# EAGLE design ppLight (EAGLE 7.2.0)
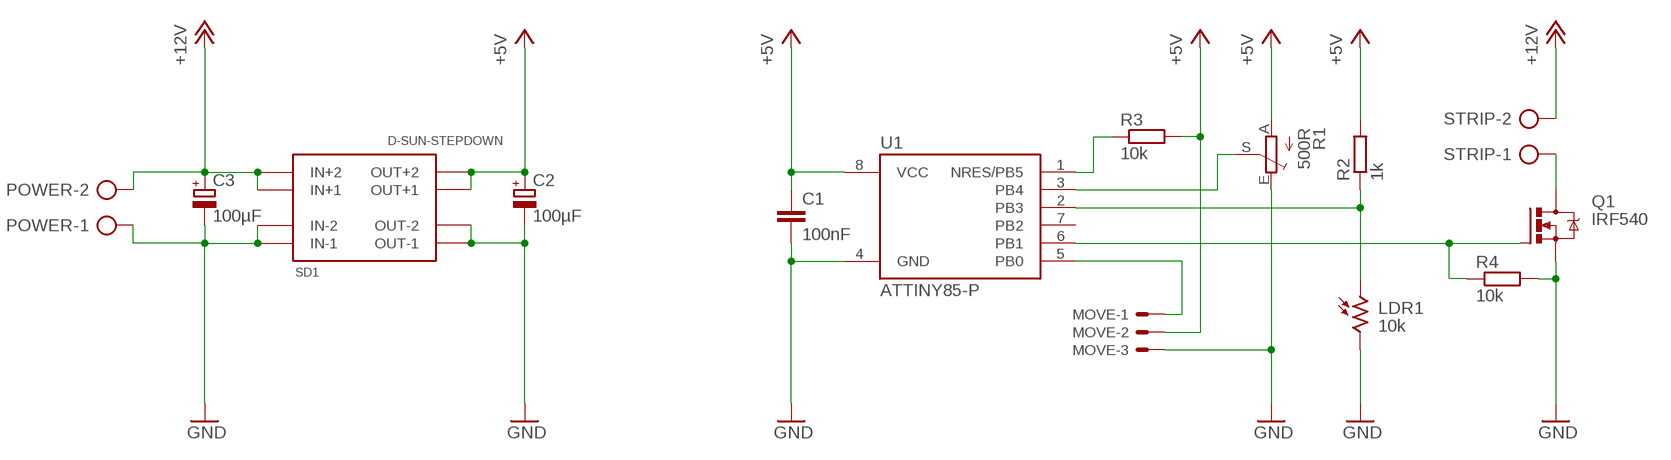
[diagram p0: schematic, sheet 1]

## Parts
C1  100nF  C-EU025-025X050  [C025-025X050]
C2  100µF  CPOL-EUE2.5-5  [E2,5-5]
C3  100µF  CPOL-EUE2.5-5  [E2,5-5]
LDR1  10k  VT90N1  [VT900]
MOVE  22-05-7038-03  [7395-03]
POWER  AK500/2  [AK500/2]
Q1  IRF540  [TO220BV]
R1  500R  TRIM_EU-CT6  [CT6]
R2  1k  R-EU_0204/7  [0204/7]
R3  10k  R-EU_0204/7  [0204/7]
R4  10k  R-EU_0204/7  [0204/7]
SD1  D-SUN-STEPDOWN  [STEPDOWN-21X16]
STRIP  AK500/2  [AK500/2]
U1  ATTINY85-P  [PDIP08_300MIL]

## Nets
+5V: C1.1 C2.+ MOVE.2 R1.A R2.2 R3.2 SD1.OUT+1 SD1.OUT+2 U1.8(VCC)
+12V: C3.+ POWER.2 SD1.IN+1 SD1.IN+2 STRIP.2
GND: C1.2 C2.- C3.- LDR1.2 MOVE.3 POWER.1 Q1.S R1.E R4.2 SD1.IN-1 SD1.IN-2 SD1.OUT-1 SD1.OUT-2 U1.4(GND)
N$1: R1.S U1.3(PB4)
N$2: Q1.D STRIP.1
N$3: R3.1 U1.1(NRES/PB5)
N$4: Q1.G R4.1 U1.6(PB1)
N$5: LDR1.1 R2.1 U1.2(PB3)
N$6: MOVE.1 U1.5(PB0)
Unconnected: U1.7(PB2)

## Library data of the parts
C1 = rcl:C-EU: CAPACITOR, European symbol
C2 C3 = rcl:CPOL-EU: POLARIZED CAPACITOR, European symbol
LDR1 = photo-elements:VT9: Photoconductive Cell VT900 Series Source: http://optoelectronics.perkinelmer.com/content/Datasheets/DTS_vt900seriesdatasheet.pdf
MOVE = con-molex:22-?-03: CONNECTOR wire to board 2.54 mm (.1 inch) pitch header; OC_FARNELL: unknown; OC_NEWARK: unknown
POWER STRIP = con-ptr500:AK500/2: CONNECTOR; OC_FARNELL: unknown; OC_NEWARK: unknown
Q1 = transistor-power:IRF540: HEXFET Power MOSFET
R1 = pot:TRIM_EU-: POTENTIOMETER
R2-R4 = rcl:R-EU_: RESISTOR, European symbol
SD1 = Zap-Powerconverters:D-SUN-STEPDOWN: Step-Down-Modul (D-Sun) Step-Down-Modul vom Ebay-Chinesen. Geht von 4,5V-28V auf 0,8V-20V, maximal 3A. Die Pins sind nicht 100% passend im Raster, lassen sich aber so hinbiegen, dass das nicht auffällt.
U1 = _hhn_attiny25_45_85:ATTINY85*: ATMEL ATtiny 85 Packages: P = PDIP 08 30mil S = SOIC 08 EIAJ 208mil Technologies Note: for complete ordering code (temp. range, finish, tape&reel etc.) see www.atmel.com • Supply Voltage: V = (1.8…5.5)V | [blank] = (2.7…5.5)V • Speed: 10 = 10 MHz | 20 = 20 MHz Author: Dipl.-Ing. FH Rainer Bayer HHN Hochschule Heilbronn (Heilbronn University), rainer.bayer@hs-heilbronn.de Ingenieurbüro ing-rb, mail@ing-rb.de

## Board
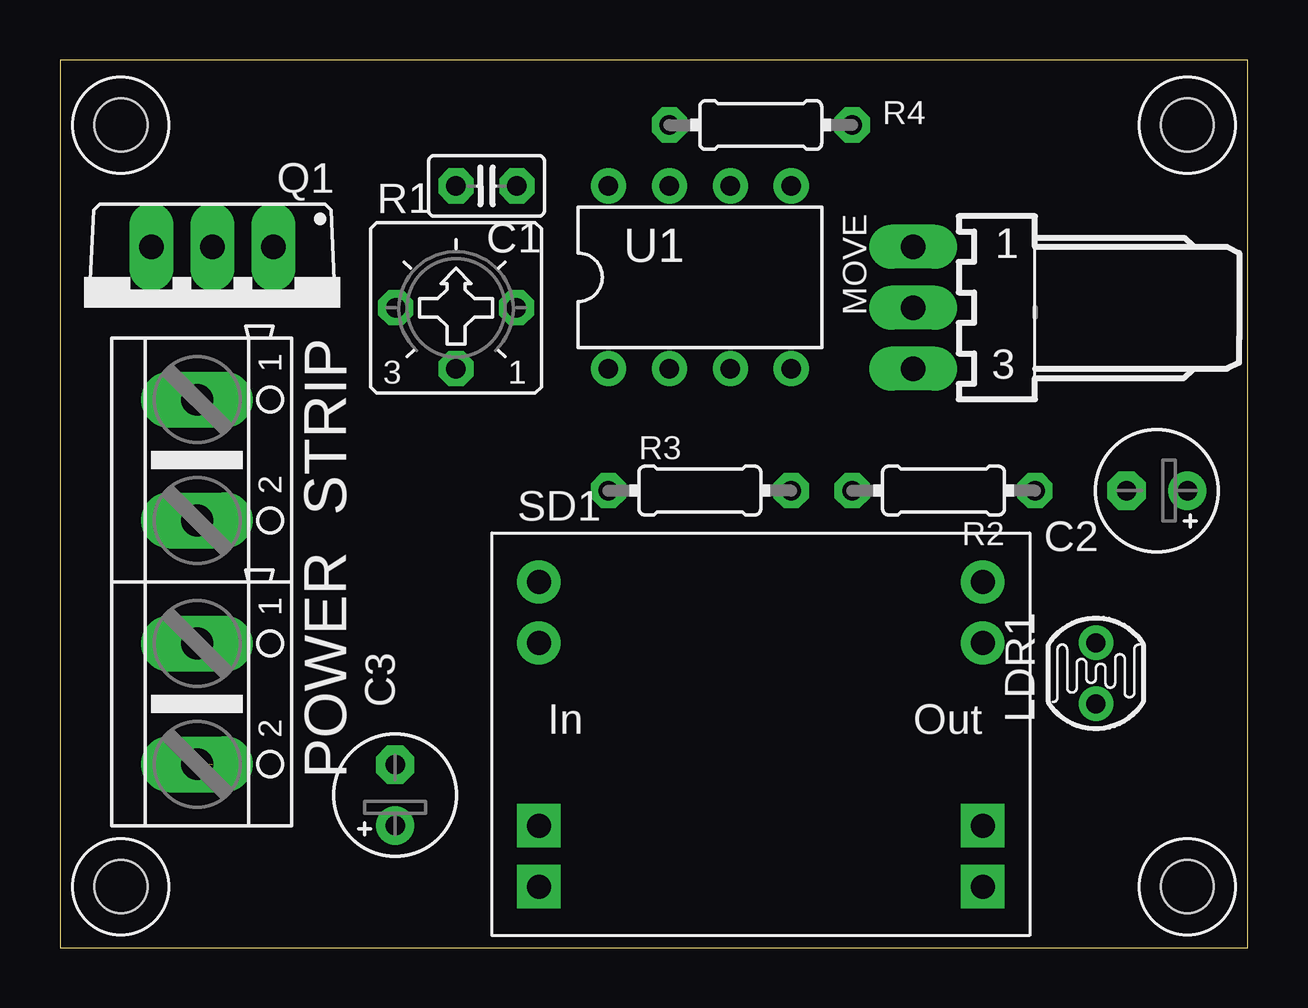
[diagram p1: board, top side]
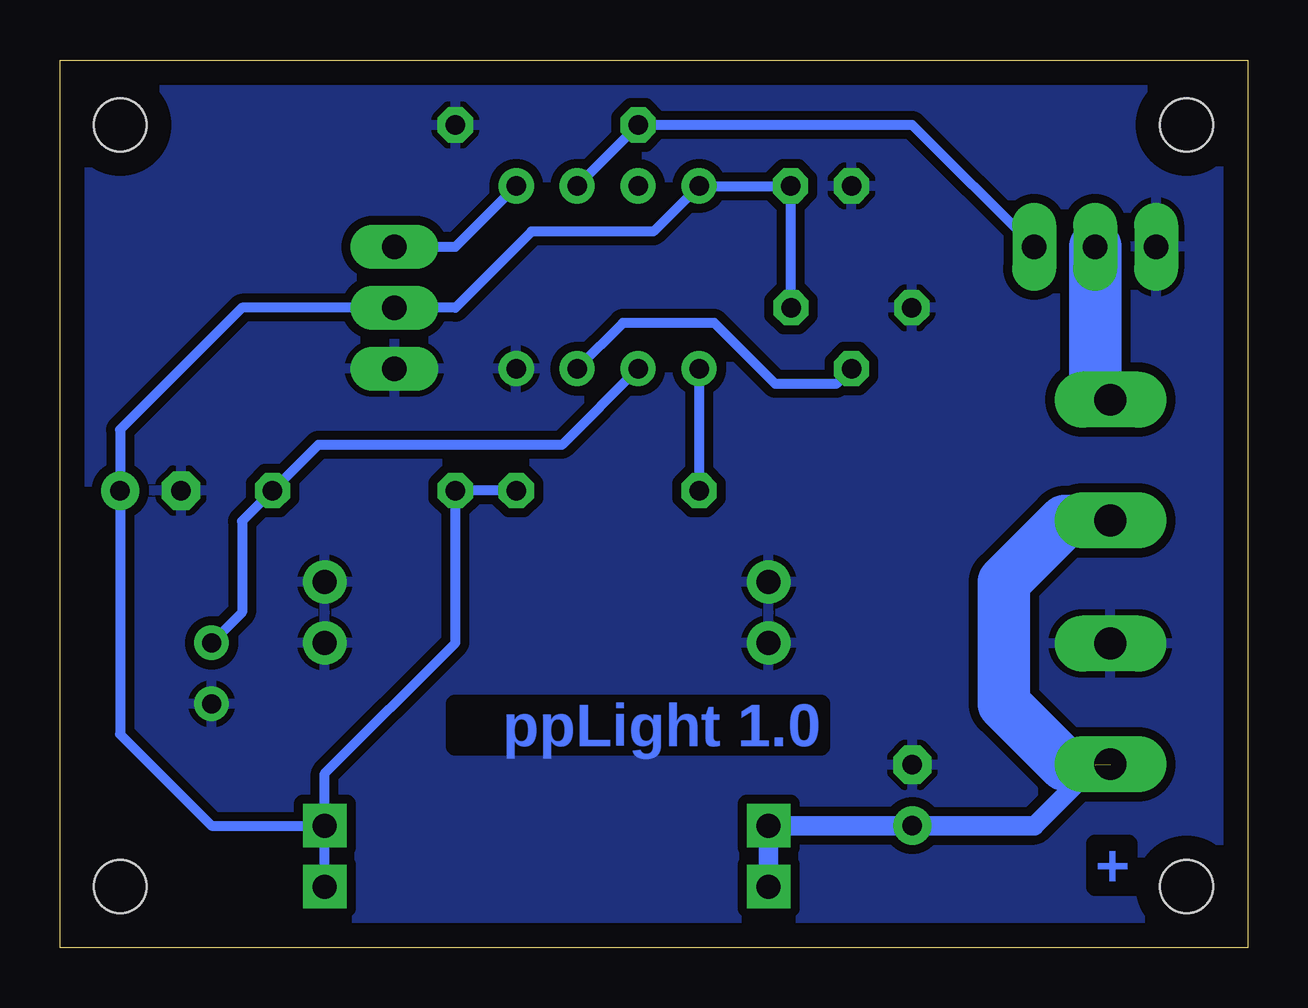
[diagram p2: board, bottom side, seen from below]

Size 49.5 x 37 mm. Coordinates in mm from the lower left corner, seen from the top.
Outline: 0,0 49.5,0 49.5,37 0,37 0,0
Copper layers (1*16): Top 0.035mm / dielectric 1.5mm / Bottom 0.035mm
Design rules "default *": minimum track width 10mil, minimum drill 24mil, track to track 15mil, track to pad 15mil, pad to pad 15mil, via to via 15mil, smd to smd 8mil, copper to edge 40mil, drill to drill 8mil, minimum pad ring 10mil, minimum via ring 8mil, stop-mask expansion 4mil, vias tented up to drill 0mil, thermal gap 10mil
Holes 2.2 mm at 46.99,2.54 46.99,34.29 2.54,34.29 2.54,2.54

### Footprints (pad centres in the part's own frame; a part is rotated, then mirrored left to right if it is on the bottom)
C025-025X050 = drill 0.813 octagon: 1 -1.27,0; 2 1.27,0
E2,5-5 = drill 0.813 pad 1.6: + -1.27,0 | drill 0.813 pad 1.6 octagon: - 1.27,0
VT900 = drill 0.8 pad 1.4: 1 -1.27,0; 2 1.27,0
7395-03 = drill 1.016 long: 1 2.54,0; 2 0,0; 3 -2.54,0
AK500/2 = drill 1.321 long: 1 -2.515,0; 2 2.515,0
TO220BV = drill 1.016 long: D 0,-2.54; G -2.54,-2.54; S 2.54,-2.54
CT6 = drill 0.813 octagon: A 2.515,0; E -2.515,0; S 0,-2.54
0204/7 = drill 0.813 octagon: 1 -3.81,0; 2 3.81,0
STEPDOWN-21X16 = drill 1 square: IN+1 -9.25,-3.81; IN+2 -9.25,-6.35; OUT+1 9.25,-3.81; OUT+2 9.25,-6.35 | drill 1: IN-1 -9.25,6.35; IN-2 -9.25,3.81; OUT-1 9.25,6.35; OUT-2 9.25,3.81
PDIP08_300MIL = drill 0.813: 1 -3.81,-3.81; 2 -1.27,-3.81; 3 1.27,-3.81; 4 3.81,-3.81; 5 3.81,3.81; 6 1.27,3.81; 7 -1.27,3.81; 8 -3.81,3.81

### Placement (x,y rotation side)
C1  17.78,31.75 180 top
C2  45.72,19.05 180 top
C3  13.97,6.35 90 top
LDR1  43.18,11.43 270 top
MOVE  35.56,26.67 90 top
POWER  5.71,10.16 270 top
Q1  6.35,26.67 180 top
R1  16.51,26.67 0 top
R2  36.83,19.05 180 top
R3  26.67,19.05 0 top
R4  29.21,34.29 0 top
SD1  29.21,8.89 0 top
STRIP  5.71,20.32 270 top
U1  26.67,27.94 0 top

### Tracks (layer width: path | path; a pad name or v marks a point on that pad's centre or on a via)
+5V
  Bottom 0.406: R3.2 R2.2 33.02,12.7 38.46,7.26 SD1.OUT+1 | SD1.OUT+2 SD1.OUT+1 | R1.A 19.05,26.7 C1.1 U1.8 24.77,29.84 29.84,29.84 33.02,26.67 MOVE.2 41.91,26.67 46.99,21.59 C2.+ 46.99,8.89 43.18,5.08 SD1.OUT+1
+12V  (1 unrouted)
  Bottom 0.813: SD1.IN+2 SD1.IN+1 C3.+ 8.89,5.08 6.35,7.62
  Bottom 2.184: POWER.2 7.59,7.64 7.62,7.62 10.16,10.16 10.16,15.24 7.62,17.78 5.74,17.78 STRIP.2
GND
  pour Bottom: 0,0 0,37 49.5,37 49.5,0
N$1
  Bottom 0.406: R1.S 17.14,23.5 19.68,23.5 22.23,26.04 26.04,26.04 U1.3
N$2
  Bottom 2.184: Q1.D 6.35,23.47 STRIP.1
N$3
  Bottom 0.406: U1.1 R3.1
N$4
  Bottom 0.406: U1.6 R4.1 13.97,34.29 Q1.G
N$5
  Bottom 0.406: LDR1.1 41.91,13.97 41.91,17.78 R2.1 38.73,20.95 28.57,20.95 U1.2
N$6
  Bottom 0.406: MOVE.1 33.02,29.21 U1.5

### Text on the board
Bottom: ppLight 1.0 | +